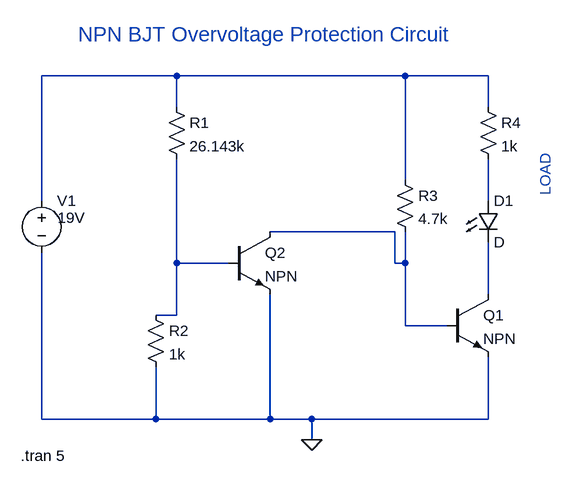
[diagram p0: schematic NPN_BJT_Overvoltage_Protection_Circuit.asc]
NPN_BJT_Overvoltage_Protection_Circuit.asc, the LTspice schematic file:
Version 4
SHEET 1 880 680
WIRE -160 -80 -368 -80
WIRE 192 -80 -160 -80
WIRE 320 -80 192 -80
WIRE -160 -32 -160 -80
WIRE 320 -32 320 -80
WIRE 192 80 192 -80
WIRE -368 112 -368 -80
WIRE 320 112 320 48
WIRE 176 160 -16 160
WIRE -160 208 -160 48
WIRE -80 208 -160 208
WIRE 176 208 176 160
WIRE 192 208 192 160
WIRE 192 208 176 208
WIRE 320 256 320 176
WIRE -160 288 -160 208
WIRE -160 288 -192 288
WIRE 192 304 192 208
WIRE 256 304 192 304
WIRE -368 448 -368 192
WIRE -192 448 -192 368
WIRE -192 448 -368 448
WIRE -16 448 -16 256
WIRE -16 448 -192 448
WIRE 48 448 -16 448
WIRE 320 448 320 352
WIRE 320 448 48 448
WIRE 48 480 48 448
FLAG 48 480 0
SYMBOL LED 304 112 R0
SYMATTR InstName D1
SYMBOL npn 256 256 R0
SYMATTR InstName Q1
SYMBOL npn -80 160 R0
SYMATTR InstName Q2
SYMBOL res -176 -48 R0
SYMATTR InstName R1
SYMATTR Value 26.143k
SYMBOL res -208 272 R0
SYMATTR InstName R2
SYMATTR Value 1k
SYMBOL res 176 64 R0
SYMATTR InstName R3
SYMATTR Value 4.7k
SYMBOL voltage -368 96 R0
WINDOW 3 46 58 Bottom 2
WINDOW 123 0 0 Left 0
WINDOW 39 0 0 Left 0
SYMATTR InstName V1
SYMATTR Value 19V
SYMBOL res 304 -48 R0
SYMATTR InstName R4
SYMATTR Value 1k
TEXT 408 104 VLeft 2 ;LOAD
TEXT -312 -144 Left 3 ;NPN BJT Overvoltage Protection Circuit
TEXT -400 504 Left 2 !.tran 5

The netlist it stands for:
* NPN_BJT_Overvoltage_Protection_Circuit.asc
D1 N002 N005 D
Q1 N005 N003 0 0 NPN
Q2 N003 N004 0 0 NPN
R1 N001 N004 26.143k
R2 N004 0 1k
R3 N001 N003 4.7k
V1 N001 0 19V
R4 N001 N002 1k
.model D D
.lib standard.dio
.model NPN NPN
.model PNP PNP
.lib standard.bjt
* LOAD
* NPN BJT Overvoltage Protection Circuit
.tran 5
.backanno
.end